# Altium schematic sheet Connectors.SchDoc
size A; SheetNumber: 13
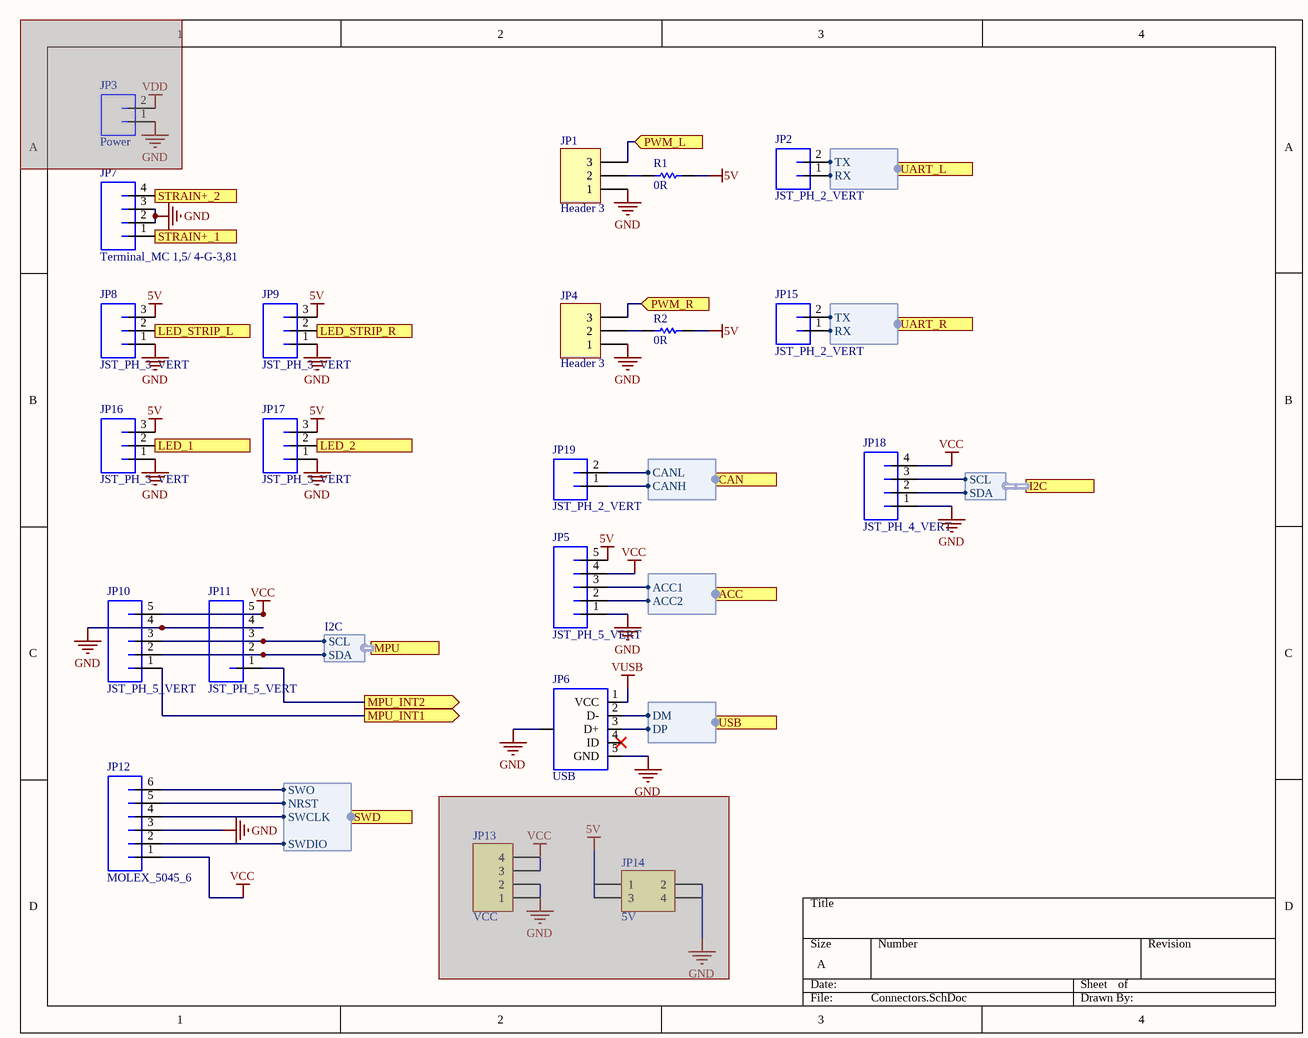
[diagram p0: Connectors.SchDoc]

## Parts
JP1  Header 3  [HDR1X3]
JP2  JST_PH_2_VERT  [JST-PH-2-PTH-VERT]
JP3  Power  [JST-PH-2-PTH-VERT]  (masked out: inside a compile mask, not in the netlist)
JP4  Header 3  [HDR1X3]
JP5  JST_PH_5_VERT  [JST-PH-5-PTH-VERT]
JP6  USB  [USB-MICROB_HORZ]
JP7  Terminal_MC 1,5/ 4-G-3,81  [Terminal-3.81-HORZ]
JP8  JST_PH_3_VERT  [JST-PH-3-PTH-VERT]
JP9  JST_PH_3_VERT  [JST-PH-3-PTH-VERT]
JP10  JST_PH_5_VERT  [JST-PH-5-PTH-VERT]
JP11  JST_PH_5_VERT  [JST-PH-5-PTH-VERT]
JP12  MOLEX_5045_6  [MOLEX_5045_6]
JP13  VCC  [HDR1X4]  (masked out: inside a compile mask, not in the netlist)
JP14  5V  [HDR2X2]  (masked out: inside a compile mask, not in the netlist)
JP15  JST_PH_2_VERT  [JST-PH-2-PTH-VERT]
JP16  JST_PH_3_VERT  [JST-PH-3-PTH-VERT]
JP17  JST_PH_3_VERT  [JST-PH-3-PTH-VERT]
JP18  JST_PH_4_VERT  [JST-PH-4-PTH-VERT]
JP19  JST_PH_2_VERT  [JST-PH-2-PTH-VERT]
R1  value 0R  [R0603[1608]]  (hidden comment: 0R 1% 0603)
R2  value 0R  [R0603[1608]]  (hidden comment: 0R 1% 0603)

## Ports
ACC (harness Accessory Outputs), CAN (harness CAN Output), I2C (harness I2C), LED_1 (in), LED_2 (in), LED_STRIP_L (in), LED_STRIP_R (in), MPU (harness I2C), MPU_INT1 (out), MPU_INT2 (out), PWM_L (in), PWM_R (in), STRAIN+_1 (in), STRAIN+_2 (in), SWD (harness SWD), UART_L (harness UART), UART_R (harness UART), USB (harness USB)

## Harnesses
USB: DM, DP
Accessory Outputs: ACC1, ACC2
CAN Output: CANL, CANH
I2C: SCL, SDA
SWD: SWCLK, SWDIO, SWO, NRST
UART: TX, RX

## Nets
5V: JP5.5 JP8.3 JP9.3 JP16.3 JP17.3 R1.2 R2.2
GND: JP1.1 JP4.1 JP5.1 JP6.5(GND) JP6.6(SHIELD) JP7.2 JP7.3 JP8.1 JP9.1 JP10.4 JP11.4 JP12.3 JP16.1 JP17.1 JP18.1
VCC: JP5.4 JP10.5 JP11.5 JP12.1 JP18.4
VUSB: JP6.1(VCC)
LED_1: JP16.2 ; port LED_1
LED_2: JP17.2 ; port LED_2
LED_STRIP_L: JP8.2 ; port LED_STRIP_L
LED_STRIP_R: JP9.2 ; port LED_STRIP_R
MPU_INT1: JP10.1 ; port MPU_INT1
MPU_INT2: JP11.1 ; port MPU_INT2
PWM_L: JP1.3 ; port PWM_L
PWM_R: JP4.3 ; port PWM_R
STRAIN+_1: JP7.1 ; port STRAIN+_1
STRAIN+_2: JP7.4 ; port STRAIN+_2
NetJP1_2: JP1.2 R1.1
NetJP2_1: JP2.1 ; port UART_L.RX
NetJP2_2: JP2.2 ; port UART_L.TX
NetJP4_2: JP4.2 R2.1
NetJP5_2: JP5.2 ; port ACC.ACC2
NetJP5_3: JP5.3 ; port ACC.ACC1
NetJP6_2: JP6.2(D-) ; port USB.DM
NetJP6_3: JP6.3(D+) ; port USB.DP
NetJP10_2: JP10.2 JP11.2 ; port MPU.SDA
NetJP10_3: JP10.3 JP11.3 ; port MPU.SCL
NetJP12_2: JP12.2 ; port SWD.SWDIO
NetJP12_4: JP12.4 ; port SWD.SWCLK
NetJP12_5: JP12.5 ; port SWD.NRST
NetJP12_6: JP12.6 ; port SWD.SWO
NetJP15_1: JP15.1 ; port UART_R.RX
NetJP15_2: JP15.2 ; port UART_R.TX
NetJP18_2: JP18.2 ; port I2C.SDA
NetJP18_3: JP18.3 ; port I2C.SCL
NetJP19_1: JP19.1 ; port CAN.CANH
NetJP19_2: JP19.2 ; port CAN.CANL

Not connected (* = marked no-connect by the designer): JP6 4(ID)*

## Library data of the parts
JP1 JP4 = Header 3: Header, 3-Pin; LatestRevisionDate: 17-Jul-2002; LatestRevisionNote: Re-released for DXP Platform.; Publisher: Altium Limited
JP2 JP15 JP19 = JST_PH_2_VERT: Manufacturer: JST Sales America Inc.; PartNumber: B2B-PH-K-S(LF)(SN); Mounting Technology: Through Hole; PackageReference: JST-PH
JP3 = JST_PH_2_VERT: Manufacturer: JST Sales America, Inc.; PartNumber: B2B-PH-K-S(LF)(SN); Mounting Technology: Through Hole; PackageReference: JST-PH
JP5 JP10 JP11 = JST_PH_5_VERT: Manufacturer: JST Sales America, Inc.; PartNumber: B5B-PH-K-S(LF)(SN); PackageReference: JST-PH; Mounting Technology: Through Hole
JP6 = USB_MICROB_SMT: pin to pad: 1>VBUS 2>D- 3>D+ 4>ID 5>GND 6>MT1+P$1+P$2+MT2; PartNumber: 10118192-0001LF; Manufacturer: Amphenol FCI; Mounting Technology: Surface Mount; PackageReference: USB - Micro B
JP7 = Terminal_MC 1,5/ 4-G-3,81: PartNumber: 1803293; Manufacturer: Phoenix Contact; MatePart: 1803594; PackageReference: MC; Mounting Technology: Through Hole
JP8 JP9 JP16 JP17 = JST_PH_3_VERT: Manufacturer: JST Sales America Inc.; PartNumber: B3B-PH-K-S(LF)(SN); Mounting Technology: Through Hole; PackageReference: JST-PH
JP12 = MOLEX_5045_6: PartNumber: B6B-PH-K-S(LF)(SN); Manufacturer: JST Sales America Inc.; PackageReference: JST-PH; Mounting Technology: Through Hole
JP13 = Header 4: Header, 4-Pin; LatestRevisionDate: 17-Jul-2002; LatestRevisionNote: Re-released for DXP Platform.; Publisher: Altium Limited
JP14 = Header 2X2: Header, 2-Pin, Dual row; LatestRevisionDate: 17-Jul-2002; LatestRevisionNote: Re-released for DXP Platform.; Publisher: Altium Limited
JP18 = JST_PH_4_VERT: PartNumber: B4B-PH-K-S(LF)(SN); Manufacturer: JST Sales America Inc.; PackageReference: JST-PH; Mounting Technology: Through Hole
R1 R2 = RES_0R_0603_1%: 0R 0.25W 1% 0603 (1005 Metric); Manufacturer: Vishay / Dale; PartNumber: CRCW06030000Z0EAHP; Tolerance: 1%; Power: 0.25W; Mounting Technology: Surface Mount; PackageReference: 0603; PackageDescription: 0603 (1608 Metric); ComponentLink1Description: Datasheet; ComponentLink1URL: http://www.vishay.com/docs/20043/crcwhpe3.pdf